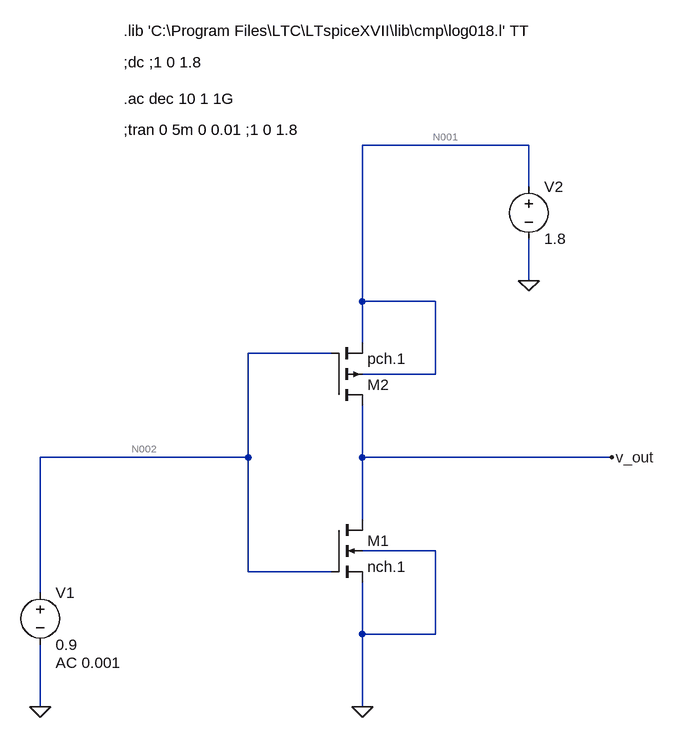
[diagram p0: schematic inverter.asc]
inverter.asc, the LTspice schematic file:
Version 4
SHEET 1 1668 1076
WIRE 288 80 32 80
WIRE 288 144 288 80
WIRE 288 288 288 224
WIRE 32 320 32 80
WIRE 144 320 32 320
WIRE 32 384 32 320
WIRE -16 400 -144 400
WIRE 144 432 144 320
WIRE 144 432 32 432
WIRE -144 560 -144 400
WIRE -144 560 -464 560
WIRE 32 560 32 480
WIRE 416 560 32 560
WIRE 32 656 32 560
WIRE 144 704 32 704
WIRE -144 736 -144 560
WIRE -16 736 -144 736
WIRE -464 768 -464 560
WIRE 32 832 32 752
WIRE 144 832 144 704
WIRE 144 832 32 832
WIRE -464 944 -464 848
WIRE 32 944 32 832
FLAG 32 944 0
FLAG 288 288 0
FLAG 416 560 v_out
FLAG -464 944 0
SYMBOL voltage 288 128 R0
WINDOW 123 0 0 Left 0
WINDOW 39 0 0 Left 0
SYMATTR InstName V2
SYMATTR Value 1.8
SYMBOL pmos4 -16 480 M180
SYMATTR InstName M2
SYMATTR Value pch.1
SYMATTR Value2 l=0.18u w=1u
SYMBOL nmos4 -16 656 R0
SYMATTR InstName M1
SYMATTR Value nch.1
SYMATTR Value2 l=0.18u w=3.1u
SYMBOL voltage -464 752 R0
WINDOW 123 24 124 Left 2
WINDOW 39 0 0 Left 0
SYMATTR Value2 AC 0.001
SYMATTR InstName V1
SYMATTR Value 0.9
TEXT -336 -96 Left 2 !.lib 'C:\\Program Files\\LTC\\LTspiceXVII\\lib\\cmp\\log018.l' TT
TEXT -336 8 Left 2 !.ac dec 10 1 1G
TEXT -336 -48 Left 2 !;dc ;1 0 1.8
TEXT -336 56 Left 2 !;tran 0 5m 0 0.01 ;1 0 1.8

The netlist it stands for:
* inverter.asc
V2 N001 0 1.8
M2 v_out N002 N001 N001 pch.1 l=0.18u w=1u
M1 v_out N002 0 0 nch.1 l=0.18u w=3.1u
V1 N002 0 0.9 AC 0.001
.model NMOS NMOS
.model PMOS PMOS
.lib standard.mos
.lib 'C:\Program Files\LTC\LTspiceXVII\lib\cmp\log018.l' TT
.ac dec 10 1 1G
;dc ;1 0 1.8
;tran 0 5m 0 0.01 ;1 0 1.8
.backanno
.end

* Results of the author's LTspice run, read from the files saved beside the schematic
* Operating Point, zero values left out:
*   V(n001) = 1.8 V
*   V(v_out) = 950.4 mV
*   V(n002) = 900 mV
*   Id(M1) = 14.76 µA
*   Ib(M1) = -21.54 pA
*   Is(M1) = -14.76 µA
*   Id(M2) = -14.76 µA
*   Is(M2) = 14.76 µA
*   I(V2) = -14.76 µA
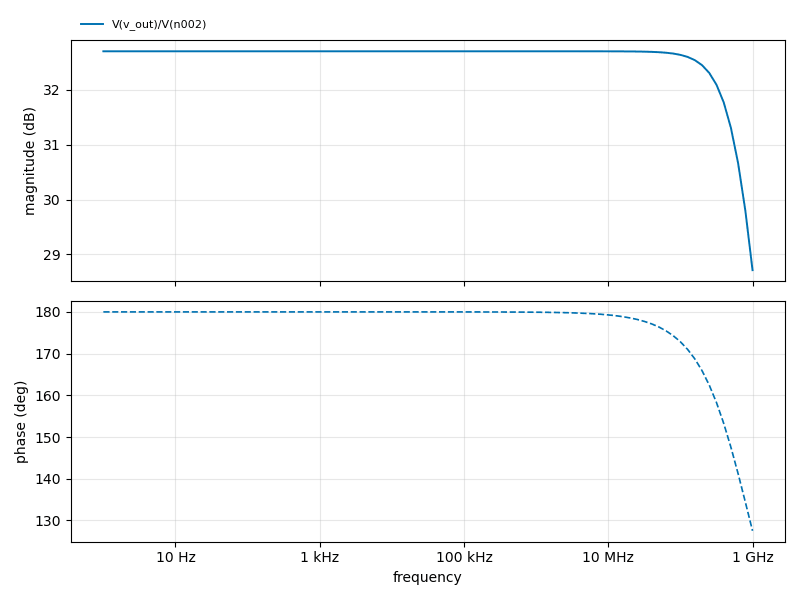
[diagram p1: AC Analysis of inverter.asc, plotted from the saved traces]
* AC Analysis, 1 run:
*   V(v_out)/V(n002): 32.70 dB at 1 Hz, 28.71 dB at 1 GHz, peak 32.70 dB at 1 Hz, 3 dB below the peak at 812.8 MHz